# Altium schematic sheet TP1_NodoWiFi_blk_Rev0.SchDoc: TP1 Nodo WiFi blk Rev0
size A4; Author: Alejandro Dario Sobral; SheetNumber: 1; SheetTotal: 5
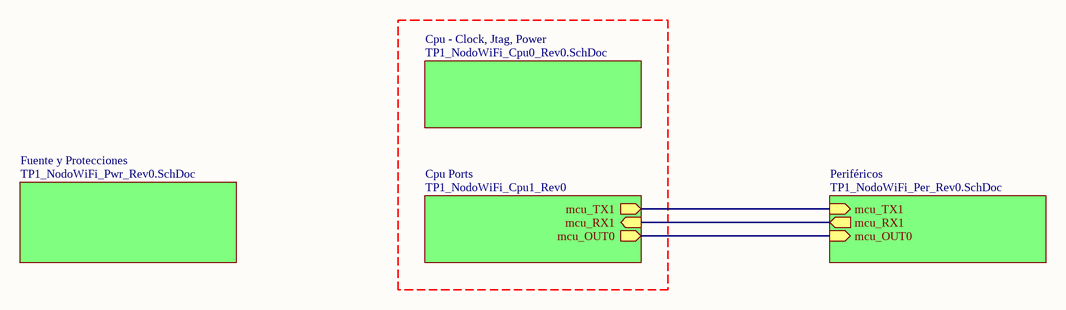
[diagram p0: TP1_NodoWiFi_blk_Rev0.SchDoc]

## Sub-sheets
Cpu - Clock, Jtag, Power = TP1_NodoWiFi_Cpu0_Rev0.SchDoc: no entries
Cpu Ports = TP1_NodoWiFi_Cpu1_Rev0: mcu_TX1 (out), mcu_RX1 (in), mcu_OUT0 (out)
Fuente y Protecciones = TP1_NodoWiFi_Pwr_Rev0.SchDoc: no entries
Periféricos = TP1_NodoWiFi_Per_Rev0.SchDoc: mcu_TX1 (in), mcu_RX1 (out), mcu_OUT0 (in)

## Nets
(unnamed): sheet Cpu Ports/mcu_TX1, sheet Periféricos/mcu_TX1
(unnamed): sheet Cpu Ports/mcu_RX1, sheet Periféricos/mcu_RX1
(unnamed): sheet Cpu Ports/mcu_OUT0, sheet Periféricos/mcu_OUT0

## Notes on the sheet
- Title:
- Size:
- Author:
- A4
- Sheet
- of
- Revision:
- File:
- Date: